# Altium schematic sheet [06] - Digital signal.SchDoc
size A
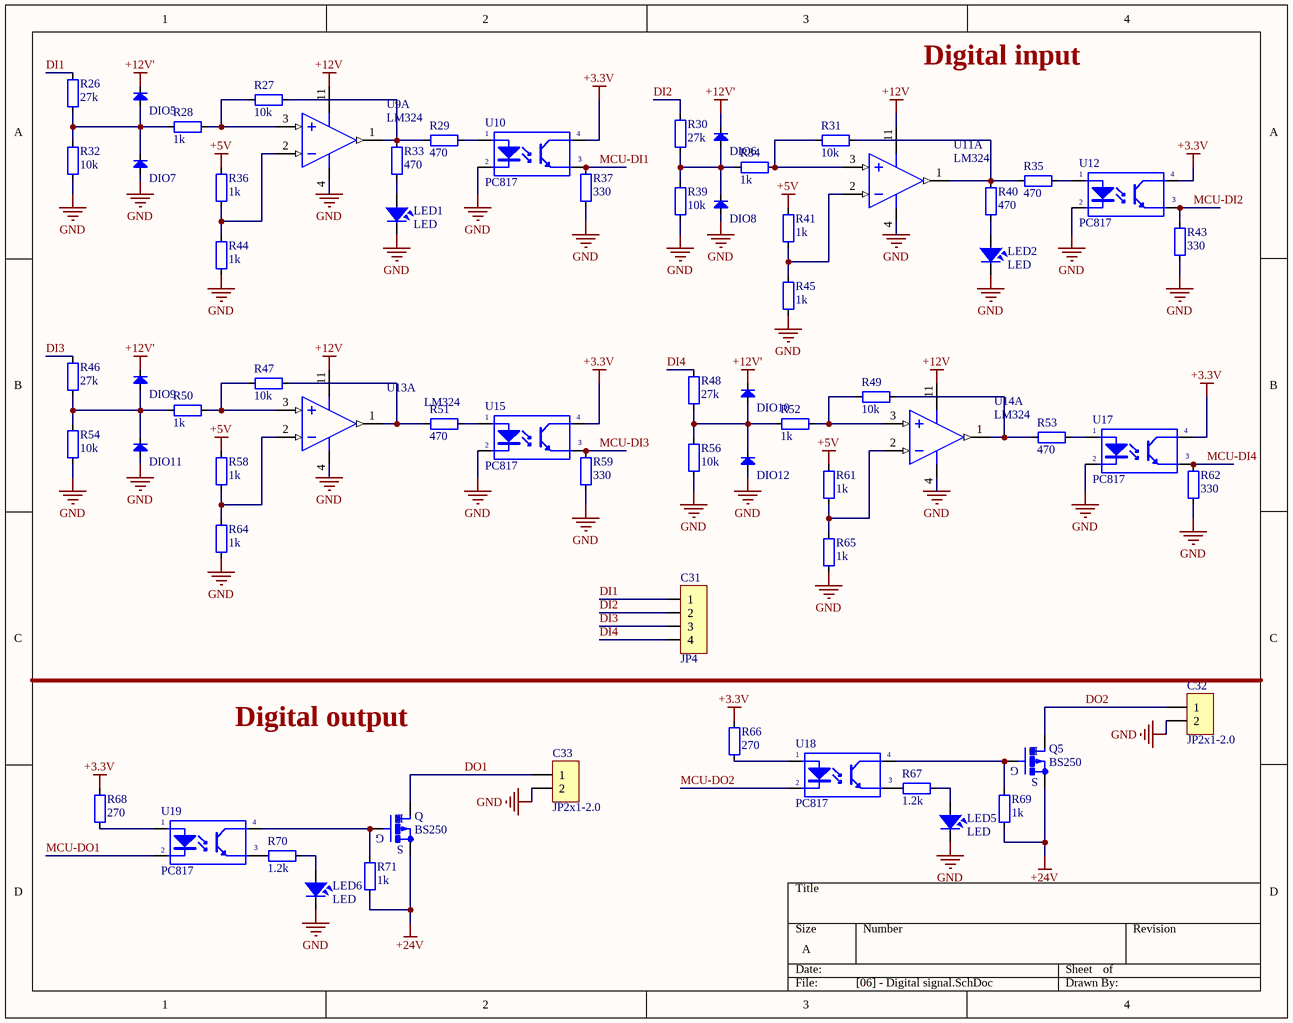
[diagram p0: [06] - Digital signal.SchDoc]

## Parts
C31  JP4  [JP4-C1T]
C32  JP2x1-2.0  [J2-C1T]
C33  JP2x1-2.0  [J2-C1T]
DIO5  Diode SMD  [DO-214AB(SMC)]  (value not drawn)
DIO6  Diode SMD  [DO-214AB(SMC)]  (value not drawn)
DIO7  Diode SMD  [DO-214AB(SMC)]  (value not drawn)
DIO8  Diode SMD  [DO-214AB(SMC)]  (value not drawn)
DIO9  Diode SMD  [DO-214AB(SMC)]  (value not drawn)
DIO10  Diode SMD  [DO-214AB(SMC)]  (value not drawn)
DIO11  Diode SMD  [DO-214AB(SMC)]  (value not drawn)
DIO12  Diode SMD  [DO-214AB(SMC)]  (value not drawn)
LED1  LED  [LED-3]
LED2  LED  [LED-3]
LED5  LED  [LED-3]
LED6  LED  [LED-3]
Q  BS250  [SOT54E]
Q5  BS250  [SOT54E]
R26  27k  [RES-SMD-0101]
R27  10k  [RES-SMD-0101]
R28  1k  [RES-SMD-0101]
R29  470  [RES-SMD-0101]
R30  27k  [RES-SMD-0101]
R31  10k  [RES-SMD-0101]
R32  10k  [RES-SMD-0101]
R33  470  [RES-SMD-0101]
R34  1k  [RES-SMD-0101]
R35  470  [RES-SMD-0101]
R36  1k  [RES-SMD-0101]
R37  330  [RES-SMD-0101]
R39  10k  [RES-SMD-0101]
R40  470  [RES-SMD-0101]
R41  1k  [RES-SMD-0101]
R43  330  [RES-SMD-0101]
R44  1k  [RES-SMD-0101]
R45  1k  [RES-SMD-0101]
R46  27k  [RES-SMD-0101]
R47  10k  [RES-SMD-0101]
R48  27k  [RES-SMD-0101]
R49  10k  [RES-SMD-0101]
R50  1k  [RES-SMD-0101]
R51  470  [RES-SMD-0101]
R52  1k  [RES-SMD-0101]
R53  470  [RES-SMD-0101]
R54  10k  [RES-SMD-0101]
R56  10k  [RES-SMD-0101]
R58  1k  [RES-SMD-0101]
R59  330  [RES-SMD-0101]
R61  1k  [RES-SMD-0101]
R62  330  [RES-SMD-0101]
R64  1k  [RES-SMD-0101]
R65  1k  [RES-SMD-0101]
R66  270  [RES-SMD-0101]
R67  1.2k  [RES-SMD-0101]
R68  270  [RES-SMD-0101]
R69  1k  [RES-SMD-0101]
R70  1.2k  [RES-SMD-0101]
R71  1k  [RES-SMD-0101]
U9  LM324  [SO14]  (part A of 4)
U10  PC817  [DIP4/W0.3]
U11  LM324  [SO14]  (part A of 4)
U12  PC817  [DIP4/W0.3]
U13  LM324  [SO14]  (part A of 4)
U14  LM324  [SO14]  (part A of 4)
U15  PC817  [DIP4/W0.3]
U17  PC817  [DIP4/W0.3]
U18  PC817  [DIP4/W0.3]
U19  PC817  [DIP4/W0.3]

## Nets
+3.3V: R66.2 R68.2 U10.4(C) U12.4(C) U15.4(C) U17.4(C)
+5V: R36.1 R41.1 R58.1 R61.1
+12V: U9.11(VEE) U11.11(VEE) U13.11(VEE) U14.11(VEE)
+12V': DIO5.2(K) DIO6.2(K) DIO9.2(K) DIO10.2(K)
+24V: Q.S Q5.S R69.2 R71.2
GND: C32.2 C33.2 DIO7.1(A) DIO8.1(A) DIO11.1(A) DIO12.1(A) LED1.2 LED2.2 LED5.2 LED6.2 R32.1 R37.2 R39.1 R43.2 R44.2 R45.2 R54.1 R56.1 R59.2 R62.2 R64.2 R65.2 U9.4(VCC) U10.2(K) U11.4(VCC) U12.2(K) U13.4(VCC) U14.4(VCC) U15.2(K) U17.2(K)
DI1: C31.1 R26.2
DI2: C31.2 R30.2
DI3: C31.3 R46.2
DI4: C31.4 R48.2
DO1: C33.1 Q.D
DO2: C32.1 Q5.D
MCU-DI1: R37.1 U10.3(E)
MCU-DI2: R43.1 U12.3(E)
MCU-DI3: R59.1 U15.3(E)
MCU-DI4: R62.1 U17.3(E)
MCU-DO1: U19.2(K)
MCU-DO2: U18.2(K)
NetDIO5_1: DIO5.1(A) DIO7.2(K) R26.1 R28.2 R32.2
NetDIO6_1: DIO6.1(A) DIO8.2(K) R30.1 R34.2 R39.2
NetDIO9_1: DIO9.1(A) DIO11.2(K) R46.1 R50.2 R54.2
NetDIO10_1: DIO10.1(A) DIO12.2(K) R48.1 R52.2 R56.2
NetLED1_1: LED1.1 R33.2
NetLED2_1: LED2.1 R40.2
NetLED5_1: LED5.1 R67.1
NetLED6_1: LED6.1 R70.1
NetQ5_G: Q5.G R69.1 U18.4(C)
NetQ_G: Q.G R71.1 U19.4(C)
NetR27_1: R27.1 R29.2 R33.1 U9.1(1_OUT)
NetR27_2: R27.2 R28.1 U9.3(1_IN+)
NetR29_1: R29.1 U10.1(A)
NetR31_1: R31.1 R35.2 R40.1 U11.1(1_OUT)
NetR31_2: R31.2 R34.1 U11.3(1_IN+)
NetR35_1: R35.1 U12.1(A)
NetR36_2: R36.2 R44.1 U9.2(1_IN-)
NetR41_2: R41.2 R45.1 U11.2(1_IN-)
NetR47_1: R47.1 R51.2 U13.1(1_OUT)
NetR47_2: R47.2 R50.1 U13.3(1_IN+)
NetR49_1: R49.1 R53.2 U14.1(1_OUT)
NetR49_2: R49.2 R52.1 U14.3(1_IN+)
NetR51_1: R51.1 U15.1(A)
NetR53_1: R53.1 U17.1(A)
NetR58_2: R58.2 R64.1 U13.2(1_IN-)
NetR61_2: R61.2 R65.1 U14.2(1_IN-)
NetR66_1: R66.1 U18.1(A)
NetR67_2: R67.2 U18.3(E)
NetR68_1: R68.1 U19.1(A)
NetR70_2: R70.2 U19.3(E)

## Notes on the sheet
- Digital input
- Digital output

## Library data of the parts
C31 = JP4: WR-PHD 2.54 mm Angled Socket Header; Manufacturer: W¨¹rth Elektronik eiSos GmbH; partNo: 613004143121; ComponentLink1 Description: Manufacturer; ComponentLink2 Description: Datasheet; NoPins: 04; Created Date: 29 March 2013; ComponentLink1URL: http://www.we-online.com; ComponentLink2URL: http://katalog.we-online.de/em/datasheet/6130xx143121.pdf; Created by: Karrer Zheng
C32 C33 = JP2x1-2.0: WR-PHD 2.00 mm Socket Header; Manufacturer: W¨¹rth Elektronik eiSos GmbH; partNo: 62000211821; ComponentLink1 Description: Manufacturer; ComponentLink2 Description: Datasheet; NoPins: 02; Created Date: 2 April 2013; ComponentLink1URL: http://www.we-online.com; ComponentLink2URL: http://katalog.we-online.de/em/datasheet/6200xx11821.pdf; Created by: Karrer Zheng
DIO5-DIO12 = Diode SMD: Default Diode; Code - JEDEC: DO-214-AB; Value: 1N5007; Published: 8-Jun-2000; Revision: July-2002: Re-released for DXP Platform.; Publisher: Altium Limited
LED1 LED2 LED5 LED6 = LED: LED Single colour Green and Red; Value: LED 3 ly Single Colour
Q Q5 = BS250: P-Channel 45V 90mA _Ta_ 330mW _Ta_ Surface Mount SOT-23-3; MF: Boca Semiconductor; SnapEDA_Link: https://www.snapeda.com/parts/BS250/Boca%20Semiconductor/view-part/2723900/?ref=snap; Availability: Unavailable; MP: BS250; Price: None; Value: *; Package: TO-236-3 Boca Semiconductor
R26-R37 R39-R41 R43-R54 R56 R58 R59 R61 R62 R64-R71 = Resistor - SMD: Resistor; Manufacturer: Generic Components; Class: Passive; Published: 08/06/2000; Publisher: Altium Hobart Technology Centre
U9 U11 U13 U14 = LF347: Low Power Quad Operational Amplifier; Manufacturer Part Number: LF347BD; Manufacturer: Texas Instruments; Text Field1: pristel=Nsc\nsanopea\<parttype>.ckt; Slew Rate: 13 V/µs; Voltage - Supply, Single/Dual (±): 7 V ~ 36 V, ±3.5 V ~ 18 V; Current - Input Bias: 50pA; Voltage - Input Offset: 3000µV; Number of Circuits: 4; Gain Bandwidth Product: 3MHz; Amplifier Type: J-FET; Current - Supply: 8mA; Supplier 1: Digi-Key; Supplier Part Number 1: 296-7136-5-ND; Package / Case: 14-SOIC (3.9mm Width), 14-SOL; Supplier: Digi-Key; Current - Output / Channel: -; Packaging: Tube; RoHS: RoHS Compliant; Output Type: -; Operating Temperature: 0°C ~ 70°C; Category: Integrated Circuits (ICs); Supplier Part Number: 296-7136-5-ND
U10 U12 U15 U17-U19 = PC817: Single Opto; Value: PC817